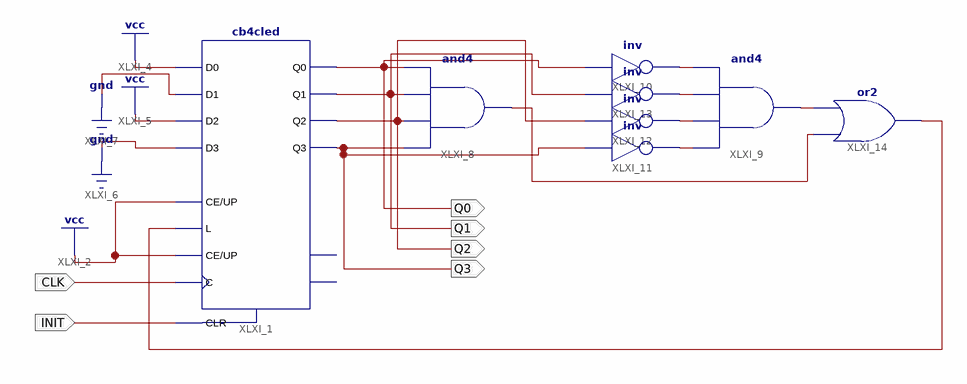
[diagram p0: schematic sheet 1]
// Xilinx ISE schematic p3ej2.sch (spartan3) as structural Verilog: 8 symbols, 6 ports
module p3ej2 (
  input  CLK,
  input  INIT,
  output Q0,
  output Q1,
  output Q2,
  output Q3
);

  wire XLXN_27, XLXN_28, XLXN_29, XLXN_30, XLXN_31, XLXN_32, XLXN_33;

  cb4cled XLXI_1 (
    .C(CLK), .CE(1'b1), .CLR(INIT), .D0(1'b1), .D1(1'b0), .D2(1'b1), .D3(1'b0), .L(XLXN_33), .UP(1'b1),
    .Q0(Q0), .Q1(Q1), .Q2(Q2), .Q3(Q3));  // open: CEO, TC
  and XLXI_8 (XLXN_32, Q3, Q2, Q1, Q0);
  and XLXI_9 (XLXN_31, XLXN_28, XLXN_29, XLXN_30, XLXN_27);
  not XLXI_10 (XLXN_27, Q0);
  not XLXI_11 (XLXN_28, Q3);
  not XLXI_12 (XLXN_29, Q2);
  not XLXI_13 (XLXN_30, Q1);
  or XLXI_14 (XLXN_33, XLXN_32, XLXN_31);
endmodule
